# EAGLE schematic Powerbank (EAGLE 7.6.0)
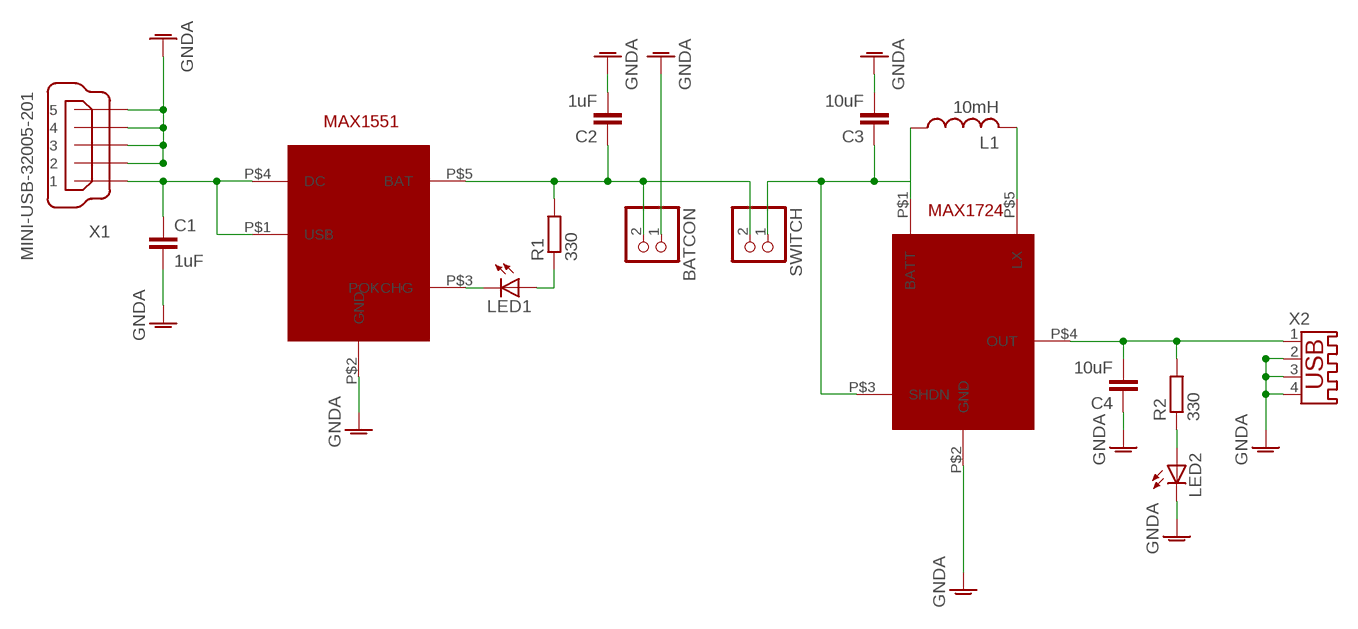
[diagram p0: schematic, sheet 1]

## Parts
BATCON  PINHD-1X2  [1X02]
C1  1uF  C-EUC0805  [C0805]
C2  1uF  C-EUC0805  [C0805]
C3  10uF  C-EUC0805  [C0805]
C4  10uF  C-EUC0805  [C0805]
L1  10mH  L-USL3216C  [L3216C]
LED1  LEDCHIP-LED0805  [CHIP-LED0805]
LED2  LEDCHIP-LED0805  [CHIP-LED0805]
R1  330  R-EU_R0805  [R0805]
R2  330  R-EU_R0805  [R0805]
SWITCH  PINHD-1X2  [1X02]
U$1  MAX1551  [SOT23]
U$2  MAX1724  [SOT23]
X1  MINI-USB-32005-201  [32005-201]
X2  USB-A003  [USB-A003]

## Nets
GNDA: BATCON.1 C1.2 C2.2 C3.2 C4.1 LED2.C U$1.P$2(GND) U$2.P$2(GND) X1.2 X1.3 X1.4 X1.5 X2.2 X2.3 X2.4
N$1: BATCON.2 C2.1 R1.2 SWITCH.2 U$1.P$5(BAT)
N$2: C1.1 U$1.P$1(USB) U$1.P$4(DC) X1.1
N$3: L1.2 U$2.P$5(LX)
N$4: C4.2 R2.2 U$2.P$4(OUT) X2.1
N$5: LED1.C U$1.P$3(POKCHG)
N$6: C3.1 L1.1 SWITCH.1 U$2.P$1(BATT) U$2.P$3(SHDN)
N$7: LED1.A R1.1
N$8: LED2.A R2.1

## Library data of the parts
BATCON SWITCH = pinhead:PINHD-1X2: PIN HEADER
C1-C4 = resistor:C-EU: CAPACITOR, European symbol
L1 = resistor:L-US: INDUCTOR, American symbol
LED1 LED2 = led:LED: LED OSRAM: - CHIPLED LG R971, LG N971, LY N971, LG Q971, LY Q971, LO R971, LY R971 LH N974, LH R974 LS Q976, LO Q976, LY Q976 LO Q996 - Hyper CHIPLED LW Q18S LB Q993, LB Q99A, LB R99A - SideLED LS A670, LO A670, LY A670, LG A670, LP A670 LB A673, LV A673, LT A673, LW A673 LH A674 LY A675 LS A676, LA A676, LO A676, LY A676, LW A676 LS A679, LY A679, LG A679 - Hyper Micro SIDELED® LS Y876, LA Y876, LO Y876, LY Y876 LT Y87S - SmartLED LW L88C, LW L88S LB L89C, LB L89S, LG L890 LS L89K, LO L89K, LY L89K LS L896, LA L896, LO L896, LY L896 - TOPLED LS T670, LO T670, LY T670, LG T670, LP T670 LSG T670, LSP T670, LSY T670, LOP T670, LYG T670 LG T671, LOG T671, LSG T671 LB T673, LV T673, LT T673, LW T673 LH T674 LS T676, LA T676, LO T676, LY T676, LB T676, LH T676, LSB T676, LW T676 LB T67C, LV T67C, LT T67C, LS T67K, LO T67K, LY T67K, LW E67C LS E67B, LA E67B, LO E67B, LY E67B, LB E67C, LV E67C, LT E67C LW T67C LS T679, LY T679, LG T679 LS T770, LO T770, LY T770, LG T770, LP T770 LB T773, LV T773, LT T773, LW T773 LH T774 LS E675, LA E675, LY E675, LS T675 LS T776, LA T776, LO T776, LY T776, LB T776 LHGB T686 LT T68C, LB T68C - Hyper Mini TOPLED® LB M676 - Mini TOPLED Santana® LG M470 LS M47K, LO M47K, LY M47K Source: http://www.osram.convergy.de LUXEON: - LUMILED® LXK2-PW12-R00, LXK2-PW12-S00, LXK2-PW14-U00, LXK2-PW14-V00 LXK2-PM12-R00, LXK2-PM12-S00, LXK2-PM14-U00 LXK2-PE12-Q00, LXK2-PE12-R00, LXK2-PE12-S00, LXK2-PE14-T00, LXK2-PE14-U00 LXK2-PB12-K00, LXK2-PB12-L00, LXK2-PB12-M00, LXK2-PB14-N00, LXK2-PB14-P00, LXK2-PB14-Q00 LXK2-PR12-L00, LXK2-PR12-M00, LXK2-PR14-Q00, LXK2-PR14-R00 LXK2-PD12-Q00, LXK2-PD12-R00, LXK2-PD12-S00 LXK2-PH12-R00, LXK2-PH12-S00 LXK2-PL12-P00, LXK2-PL12-Q00, LXK2-PL12-R00 Source: www.luxeon.com KINGBRIGHT: KA-3528ASYC Source: www.kingbright.com
R1 R2 = resistor:R-EU_: RESISTOR, European symbol
U$1 = powerbank:MAX1551
U$2 = powerbank:MAX1724
X1 = con-cypressindustries:MINI-USB-: MINI USB-B Conector Source: www.cypressindustries.com; OC_FARNELL: unknown; OC_NEWARK: unknown
X2 = con-yamaichi:USB-A003: USB connector; OC_FARNELL: unknown; OC_NEWARK: unknown